# EAGLE design displayplank (EAGLE 6.2)
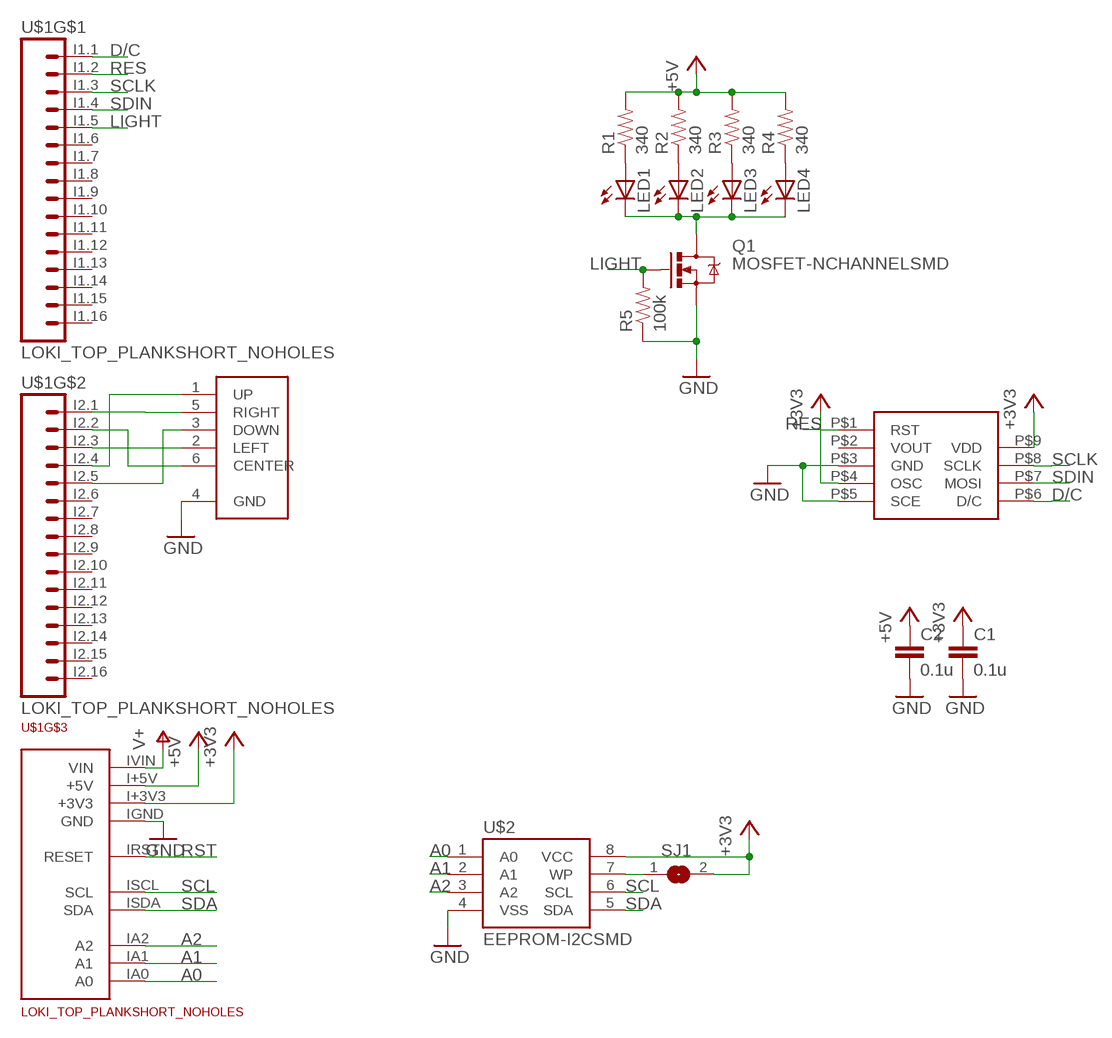
[diagram p0: schematic, sheet 1]

## Parts
C1  0.1u  CAP0805  [0805]
C2  0.1u  CAP0805  [0805]
LED1  LEDSML0805  [SML0805]
LED2  LEDSML0805  [SML0805]
LED3  LEDSML0805  [SML0805]
LED4  LEDSML0805  [SML0805]
Q1  MOSFET-NCHANNELSMD  [SOT23-3]
R1  340  RESISTOR0805-RES  [0805]
R2  340  RESISTOR0805-RES  [0805]
R3  340  RESISTOR0805-RES  [0805]
R4  340  RESISTOR0805-RES  [0805]
R5  100k  RESISTOR0805-RES  [0805]
SJ1  SJ  [SJ]
U$1  LOKI_TOP_PLANKSHORT_NOHOLES  [TOP_PLANK_SHORT_NOHOLES]
U$2  EEPROM-I2CSMD  [SO08]
U$3  JOYSTICK-10MM  [JOYSTICK-10MM]
U$5  5110-SCREEN  [5110-SCREEN]

## Nets
+3V3: C1.1 SJ1.2 U$1.I+3V3(+3V3) U$2.8(VCC) U$5.P$4(OSC) U$5.P$9(VDD)
+5V: C2.1 R1.2 R2.2 R3.2 R4.2 U$1.I+5V(+5V)
A0: U$1.IA0(A0) U$2.1(A0)
A1: U$1.IA1(A1) U$2.2(A1)
A2: U$1.IA2(A2) U$2.3(A2)
D/C: U$1.I1.1 U$5.P$6(D/C)
GND: C1.2 C2.2 Q1.2(S) R5.1 U$1.IGND(GND) U$2.4(VSS) U$3.4(GND) U$5.P$3(GND) U$5.P$5(SCE)
LIGHT: Q1.1(G) R5.2 U$1.I1.5
N$1: SJ1.1 U$2.7(WP)
N$2: LED1.A R1.1
N$3: LED2.A R2.1
N$4: LED3.A R3.1
N$5: LED4.A R4.1
N$6: LED1.C LED2.C LED3.C LED4.C Q1.3(D)
N$7: U$1.I2.4 U$3.1(UP)
N$8: U$1.I2.2 U$3.6(CENTER)
N$9: U$1.I2.3 U$3.2(LEFT)
N$10: U$1.I2.5 U$3.3(DOWN)
N$11: U$1.I2.1 U$3.5(RIGHT)
RES: U$1.I1.2 U$5.P$1(RST)
RST: U$1.IRST(RESET)
SCL: U$1.ISCL(SCL) U$2.6(SCL)
SCLK: U$1.I1.3 U$5.P$8(SCLK)
SDA: U$1.ISDA(SDA) U$2.5(SDA)
SDIN: U$1.I1.4 U$5.P$7(MOSI)
V+: U$1.IVIN(VIN)
Unconnected: U$1.I1.6 U$1.I1.7 U$1.I1.8 U$1.I1.9 U$1.I1.10 U$1.I1.11 U$1.I1.12 U$1.I1.13 U$1.I1.14 U$1.I1.15 U$1.I1.16 U$1.I2.6 U$1.I2.7 U$1.I2.8 U$1.I2.9 U$1.I2.10 U$1.I2.11 U$1.I2.12 U$1.I2.13 U$1.I2.14 U$1.I2.15 U$1.I2.16 U$5.P$2(VOUT)

## Library data of the parts
C1 C2 = SparkFun-Passives:CAP: Capacitor Standard 0603 ceramic capacitor, and 0.1" leaded capacitor.
LED1-LED4 = led:LED: LED OSRAM: - CHIPLED LG R971, LG N971, LY N971, LG Q971, LY Q971, LO R971, LY R971 LH N974, LH R974 LS Q976, LO Q976, LY Q976 LO Q996 - Hyper CHIPLED LW Q18S LB Q993, LB Q99A, LB R99A - SideLED LS A670, LO A670, LY A670, LG A670, LP A670 LB A673, LV A673, LT A673, LW A673 LH A674 LY A675 LS A676, LA A676, LO A676, LY A676, LW A676 LS A679, LY A679, LG A679 - Hyper Micro SIDELED® LS Y876, LA Y876, LO Y876, LY Y876 LT Y87S - SmartLED LW L88C, LW L88S LB L89C, LB L89S, LG L890 LS L89K, LO L89K, LY L89K LS L896, LA L896, LO L896, LY L896 - TOPLED LS T670, LO T670, LY T670, LG T670, LP T670 LSG T670, LSP T670, LSY T670, LOP T670, LYG T670 LG T671, LOG T671, LSG T671 LB T673, LV T673, LT T673, LW T673 LH T674 LS T676, LA T676, LO T676, LY T676, LB T676, LH T676, LSB T676, LW T676 LB T67C, LV T67C, LT T67C, LS T67K, LO T67K, LY T67K, LW E67C LS E67B, LA E67B, LO E67B, LY E67B, LB E67C, LV E67C, LT E67C LW T67C LS T679, LY T679, LG T679 LS T770, LO T770, LY T770, LG T770, LP T770 LB T773, LV T773, LT T773, LW T773 LH T774 LS E675, LA E675, LY E675, LS T675 LS T776, LA T776, LO T776, LY T776, LB T776 LHGB T686 LT T68C, LB T68C - Hyper Mini TOPLED® LB M676 - Mini TOPLED Santana® LG M470 LS M47K, LO M47K, LY M47K Source: http://www.osram.convergy.de LUXEON: - LUMILED® LXK2-PW12-R00, LXK2-PW12-S00, LXK2-PW14-U00, LXK2-PW14-V00 LXK2-PM12-R00, LXK2-PM12-S00, LXK2-PM14-U00 LXK2-PE12-Q00, LXK2-PE12-R00, LXK2-PE12-S00, LXK2-PE14-T00, LXK2-PE14-U00 LXK2-PB12-K00, LXK2-PB12-L00, LXK2-PB12-M00, LXK2-PB14-N00, LXK2-PB14-P00, LXK2-PB14-Q00 LXK2-PR12-L00, LXK2-PR12-M00, LXK2-PR14-Q00, LXK2-PR14-R00 LXK2-PD12-Q00, LXK2-PD12-R00, LXK2-PD12-S00 LXK2-PH12-R00, LXK2-PH12-S00 LXK2-PL12-P00, LXK2-PL12-Q00, LXK2-PL12-R00 Source: www.luxeon.com KINGBRIGHT: KA-3528ASYC Source: www.kingbright.com
Q1 = SparkFun-DiscreteSemi:MOSFET-NCHANNEL: Generic NMOS footprint
R1-R5 = SparkFun-Passives:RESISTOR: Resistor Basic schematic elements and footprints for 0603, 1206, and PTH resistors.
SJ1 = jumper:SJ: SMD solder JUMPER
U$1 = loki:LOKI_TOP_PLANK: Top plank template for Loki. For planks that cannot have others stacked on them.
U$2 = SparkFun-DigitalIC:EEPROM-I2C: I2C EEPROM chips, 24LC256 (and others)
U$3 = nickparts:JOYSTICK-10MM
U$5 = ElectricLaboratoryLib:5110-SCREEN

## Board
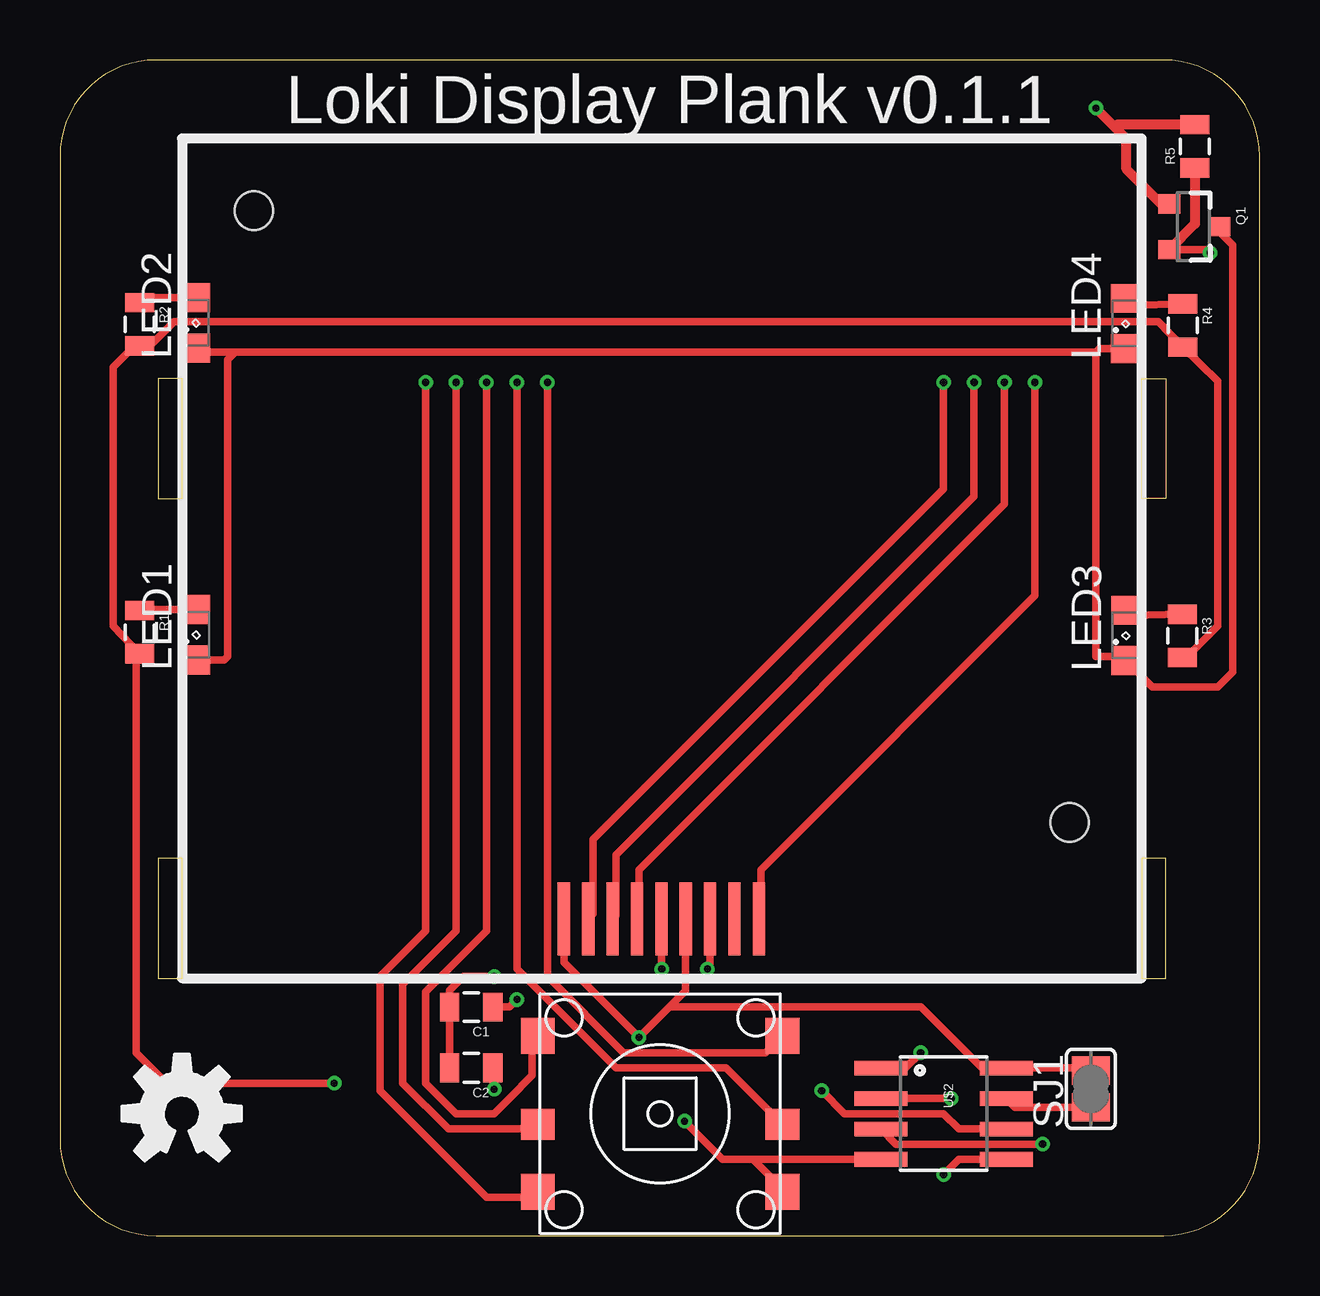
[diagram p1: board, top side]
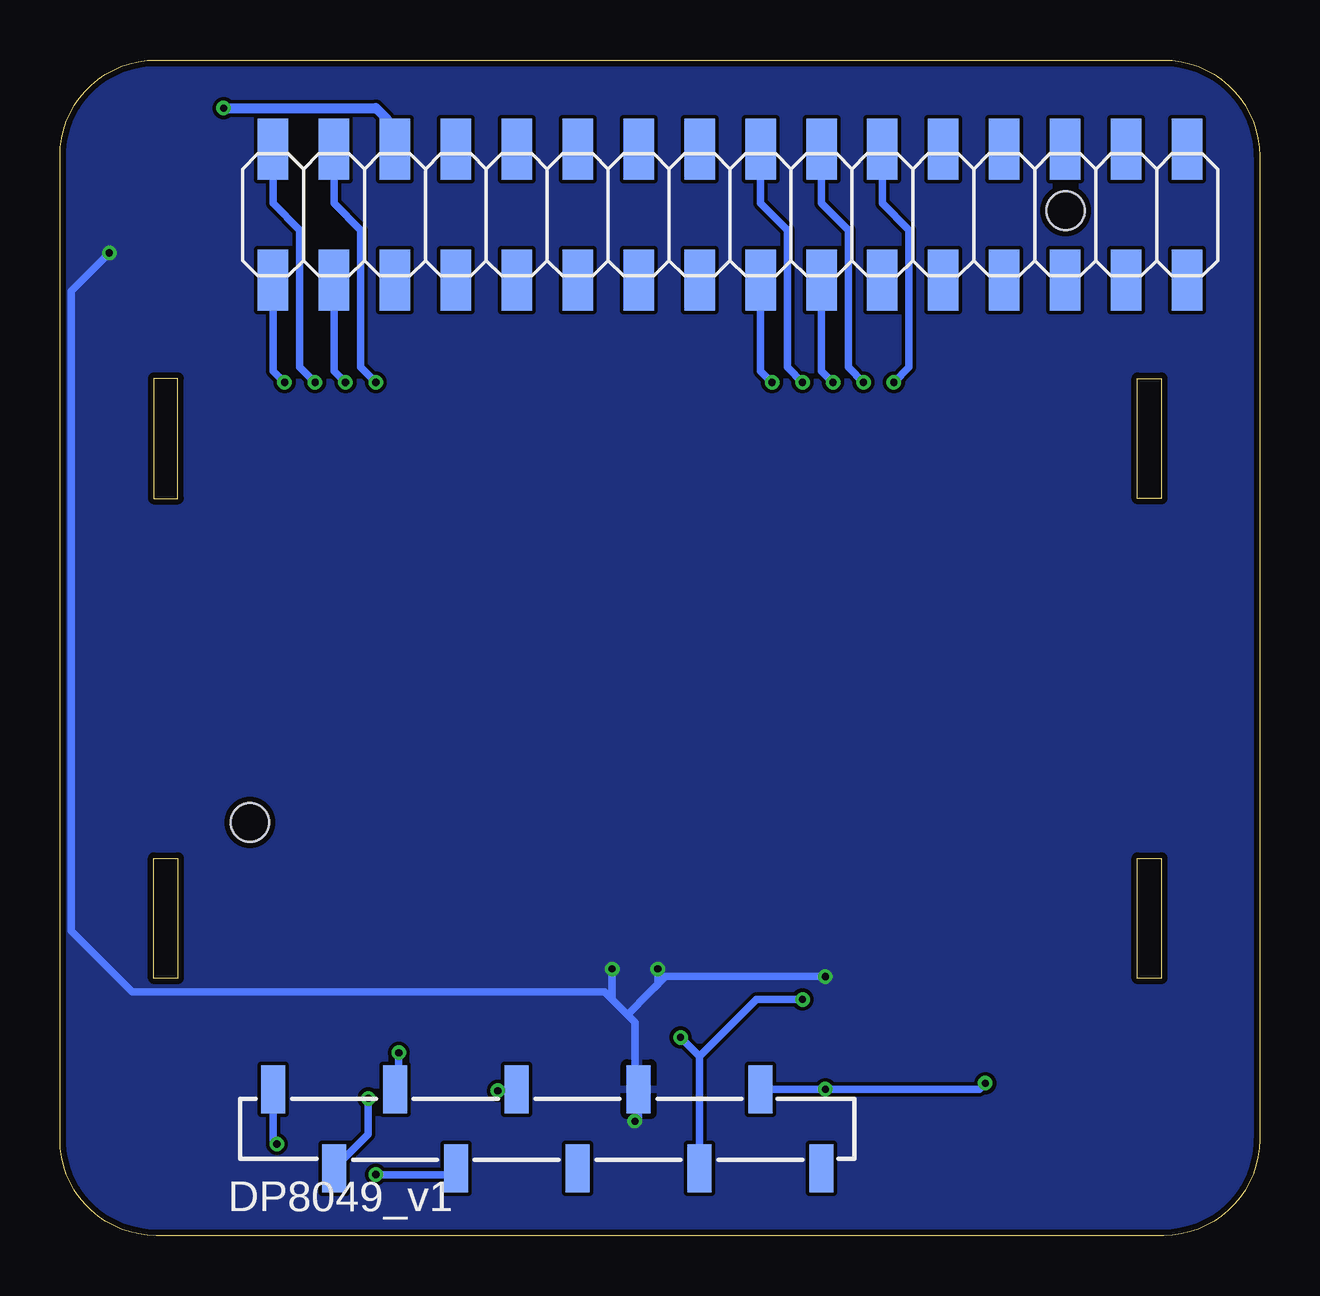
[diagram p2: board, bottom side, seen from below]

Size 50 x 49 mm. Coordinates in mm from the lower left corner, seen from the top.
Copper layers (1*16): Top 0.035mm / dielectric 1.5mm / Bottom 0.035mm
Design rules: minimum track width 6mil, minimum drill 0.3mm, track to track 6mil, track to pad 6mil, pad to pad 6mil, via to via 6mil, smd to smd 0mil, copper to edge 10mil, drill to drill 10mil, minimum pad ring 10mil, minimum via ring 6mil, stop-mask expansion 2mil, vias tented up to drill 100mil, thermal gap 10mil

### Footprints (pad centres in the part's own frame; a part is rotated, then mirrored left to right if it is on the bottom)
0805 = smd 0.8 x 1.2: 1 -0.9,0; 2 0.9,0
SML0805 = smd 1.2 x 1.2: A 1.05,0; C -1.05,0
SOT23-3 = smd 0.8 x 0.9: 1 -0.95,-1; 2 0.95,-1; 3 0,1.1
SJ = smd 1.168 x 1.6: 1 -0.762,0; 2 0.762,0
TOP_PLANK_SHORT_NOHOLES = smd 1.27 x 2.54 bottom: I1.1 41.12,45.275; I1.2 41.12,39.815; I1.3 38.58,45.275; I1.4 38.58,39.815; I1.5 36.04,45.275; I1.6 36.04,39.815; I1.7 33.5,45.275; I1.8 33.5,39.815; I1.9 30.96,45.275; I1.10 30.96,39.815; I1.11 28.42,45.275; I1.12 28.42,39.815; I1.13 25.88,45.275; I1.14 25.88,39.815; I1.15 23.34,45.275; I1.16 23.34,39.815; I2.1 20.8,45.275; I2.2 20.8,39.815; I2.3 18.26,45.275; I2.4 18.26,39.815; I2.5 15.72,45.275; I2.6 15.72,39.815; I2.7 13.18,45.275; I2.8 13.18,39.815; I2.9 10.64,45.275; I2.10 10.64,39.815; I2.11 8.1,45.275; I2.12 8.1,39.815; I2.13 5.56,45.275; I2.14 5.56,39.815; I2.15 3.02,45.275; I2.16 3.02,39.815 | smd 1 x 2 bottom: I+3V3 23.34,2.795; I+5V 20.8,6.095; IA0 36.04,6.095; IA1 38.58,2.795; IA2 41.12,6.095; IGND 25.88,6.095; IRST 28.42,2.795; ISCL 30.96,6.095; ISDA 33.5,2.795; IVIN 18.26,2.795
SO08 = smd 0.61 x 2.21: 1 -1.905,-2.616; 2 -0.635,-2.616; 3 0.635,-2.616; 4 1.905,-2.616; 5 1.905,2.616; 6 0.635,2.616; 7 -0.635,2.616; 8 -1.905,2.616
JOYSTICK-10MM = smd 1.4 x 1.5: 1 -5.1,3.25; 3 -5.1,-3.25; 4 5.1,-3.25; 6 5.1,3.25 | smd 1.4 x 1.3: 2 -5.1,-0.45; 5 5.1,-0.45
5110-SCREEN = smd 0.508 x 3.048: P$1 15.954,32.524; P$2 16.97,32.524; P$3 17.986,32.524; P$4 19.002,32.524; P$5 20.018,32.524; P$6 21.034,32.524; P$7 22.05,32.524; P$8 23.066,32.524; P$9 24.082,32.524 | hole 1.6: 3,28.5; 37,3

### Placement (x,y rotation side)
C1  17.14,9.53 180 top
C2  17.14,6.99 180 top
LED1  5.67,25.05 90 top
LED2  5.66,38.05 90 top
LED3  44.42,25.02 90 top
LED4  44.41,38.02 90 top
Q1  47.24,42.05 270 top
R1  3.32,25.15 270 top
R2  3.32,37.98 270 top
R3  46.78,25 270 top
R4  46.8,37.93 270 top
R5  47.31,45.4 90 top
SJ1  42.97,6.11 90 top
U$1  0,0 0 top
U$2  36.83,5.08 270 top
U$3  25.02,5.08 0 top
U$4  [OSHW-LOGO-M]  5.08,5.08 0 top
U$5  45.09,45.72 180 top

### Tracks (layer width: path | path; a pad name or v marks a point on that pad's centre or on a via)
+3V3  (via drill 0.3)
  Top 0.305: SJ1.2 42.86,6.99 U$2.8 38.42,6.99 37.15,8.26 35.88,9.53 25.4,9.53 | 25.4,9.53 v24.13,8.26 21,11.38 U$5.P$9 | U$5.P$4 26.08,10.21 25.4,9.53 | C1.1 18.73,9.53 v19.05,9.84
  Bottom 0.305: U$1.I+3V3 23.34,7.46 | 23.34,7.46 v24.13,8.26 23.34,7.46 | v19.05,9.84 20.96,9.84 23.34,7.46
+5V  (via drill 0.3)
  Top 0.305: R3.2 47.01,24.15 48.26,25.4 48.26,35.62 R4.2 45.78,38.1 4.76,38.1 3.79,37.13 R2.2 3.16,37.13 2.22,36.2 2.22,25.4 R1.2 3.17,24.16 3.17,7.62 4.45,6.35 v11.43,6.35 | C2.1 18.05,6.15 v18.1,6.09
  Bottom 0.305: U$1.I+5V v18.1,6.09 | v18.1,6.09 17.14,6.09 | 17.14,6.09 11.69,6.09 v11.43,6.35 | v18.1,6.09 17.14,6.09
A0  (via drill 0.3)
  Top 0.305: U$2.1 35.24,6.99 v35.88,7.62
  Bottom 0.305: v35.88,7.62 35.88,6.26 U$1.IA0
A1  (via drill 0.3)
  Top 0.305: U$2.2 v37.15,5.71
  Bottom 0.305: v37.15,5.71 37.15,4.23 U$1.IA1
A2  (via drill 0.3)
  Top 0.305: v40.96,3.81 34.85,3.81 U$2.3
  Bottom 0.305: U$1.IA2 41.12,3.97 v40.96,3.81
D/C  (via drill 0.3)
  Top 0.305: v39.37,35.56 39.37,30.48 24.13,15.24 24.13,13.28 U$5.P$6
  Bottom 0.305: U$1.I1.1 41.12,43.02 40.01,41.91 40.01,36.2 v39.37,35.56
GND  (via drill 0.3)
  Top 0.305: U$2.4 31.75,3.17 | 31.75,3.17 31.46,3.17 | v26.04,4.76 27.62,3.17 28.89,3.17 | 28.89,3.17 31.75,3.17 | U$3.4 30.11,1.95 28.89,3.17 | Q1.2 47.8,41.1 v47.94,40.96 | U$5.P$3 27.1,11.22 v26.99,11.11 | U$5.P$5 25.07,11.13 v25.08,11.11 | v18.1,10.79 16.83,10.79 16.25,10.21 C1.2 C2.2
  Top 0.406: R5.1 47.31,42.17 Q1.2
  Bottom 0.305: v26.04,4.76 25.88,4.92 U$1.IGND 26.04,6.25 26.04,8.89 26.35,9.21 | 26.83,9.68 27.3,10.16 46.99,10.16 49.53,12.7 49.53,39.37 v47.94,40.96 | 26.83,9.68 26.35,9.21 | v26.99,11.11 26.99,9.84 26.83,9.68 | v25.08,11.11 25.08,10.48 25.4,10.16 | 25.4,10.16 26.35,9.21 | v18.1,10.79 24.77,10.79 25.4,10.16
  pour Bottom: 0,0 0,49.53 50.8,49.53 50.8,0
LIGHT  (via drill 0.3)
  Top 0.305: 46.35,43.12 Q1.1
  Top 0.406: Q1.1 45.9,43 44.45,44.45 44.45,45.72 43.97,46.2 | 43.97,46.2 v43.18,46.99 | R5.2 44.08,46.3 43.97,46.2
  Bottom 0.406: v43.18,46.99 36.83,46.99 35.88,46.04 35.88,45.44 U$1.I1.5
N$1
  Top 0.305: SJ1.1 39.81,5.35 U$2.7
N$2
  Top 0.305: LED1.A 3.42,26.09 R1.1
N$3
  Top 0.305: LED2.A 3.58,39.09 R2.1
N$4
  Top 0.305: R3.1 44.63,25.85 LED3.A
N$5
  Top 0.305: R4.1 44.69,38.78 LED4.A
N$6
  Top 0.305: 43.18,36.83 43.18,35.56 43.18,24.13 44.26,24.13 LED3.C 45.52,22.86 48.26,22.86 48.9,23.5 48.9,41.27 48.34,41.83 Q1.3 | LED4.C 43.31,36.97 43.18,36.83 | 43.18,36.83 7.3,36.83 | 7.3,36.83 5.82,36.83 LED2.C | LED1.C 6.85,24 6.99,24.13 6.99,36.51 7.3,36.83
N$7  (via drill 0.3)
  Top 0.305: v17.78,35.56 17.78,12.7 15.24,10.16 15.24,7.3 15.24,6.35 16.51,5.08 18.1,5.08 18.73,5.71 19.68,6.67 19.68,7.3 19.68,8.1 U$3.1
  Bottom 0.305: U$1.I2.4 18.26,36.04 v17.78,35.56
N$8  (via drill 0.3)
  Top 0.305: v20.32,35.56 20.32,10.79 23.5,7.62 29.41,7.62 U$3.6
  Bottom 0.305: U$1.I2.2 20.8,36.04 v20.32,35.56
N$9  (via drill 0.3)
  Top 0.305: v16.51,35.56 16.51,12.7 14.29,10.48 14.29,6.99 14.29,6.35 16.19,4.45 16.83,4.45 19.73,4.45 U$3.2
  Bottom 0.305: U$1.I2.3 18.26,43.02 17.14,41.91 17.14,36.2 v16.51,35.56
N$10  (via drill 0.3)
  Top 0.305: v15.24,35.56 15.24,12.7 13.34,10.79 13.34,6.03 17.78,1.59 19.67,1.59 U$3.3
  Bottom 0.305: U$1.I2.5 15.72,43.02 14.61,41.91 14.61,36.2 v15.24,35.56
N$11  (via drill 0.3)
  Top 0.305: v19.05,35.56 19.05,11.11 23.18,6.99 27.76,6.99 U$3.5
  Bottom 0.305: U$1.I2.1 20.8,43.02 19.68,41.91 19.68,36.2 v19.05,35.56
RES  (via drill 0.3)
  Top 0.305: v40.64,35.56 40.64,26.67 29.21,15.24 29.21,13.28 U$5.P$1
  Bottom 0.305: U$1.I1.2 41.12,36.04 v40.64,35.56
SCL  (via drill 0.3)
  Top 0.305: U$2.6 37.47,4.45 36.83,5.08 32.7,5.08 v31.75,6.03
  Bottom 0.305: v31.75,6.03 31.02,6.03 U$1.ISCL
SCLK  (via drill 0.3)
  Top 0.305: v36.83,35.56 36.83,31.11 22.23,16.51 22.23,13.4 U$5.P$8
  Bottom 0.305: U$1.I1.3 38.58,43.02 37.47,41.91 37.47,36.2 v36.83,35.56
SDA  (via drill 0.3)
  Top 0.305: U$2.5 37.47,3.17 v36.83,2.54
  Bottom 0.305: v36.83,2.54 33.76,2.54 U$1.ISDA
SDIN  (via drill 0.3)
  Top 0.305: v38.1,35.56 38.1,30.8 23.18,15.88 23.18,13.34 U$5.P$7
  Bottom 0.305: U$1.I1.4 38.58,36.04 v38.1,35.56

### Text on the board
tNames: Loki Display Plank v0.1.1